# Altium schematic sheet EVAL-CN0349-PMDZ-AltiumDesignerSchematic-Rev0.SchDoc
size A4
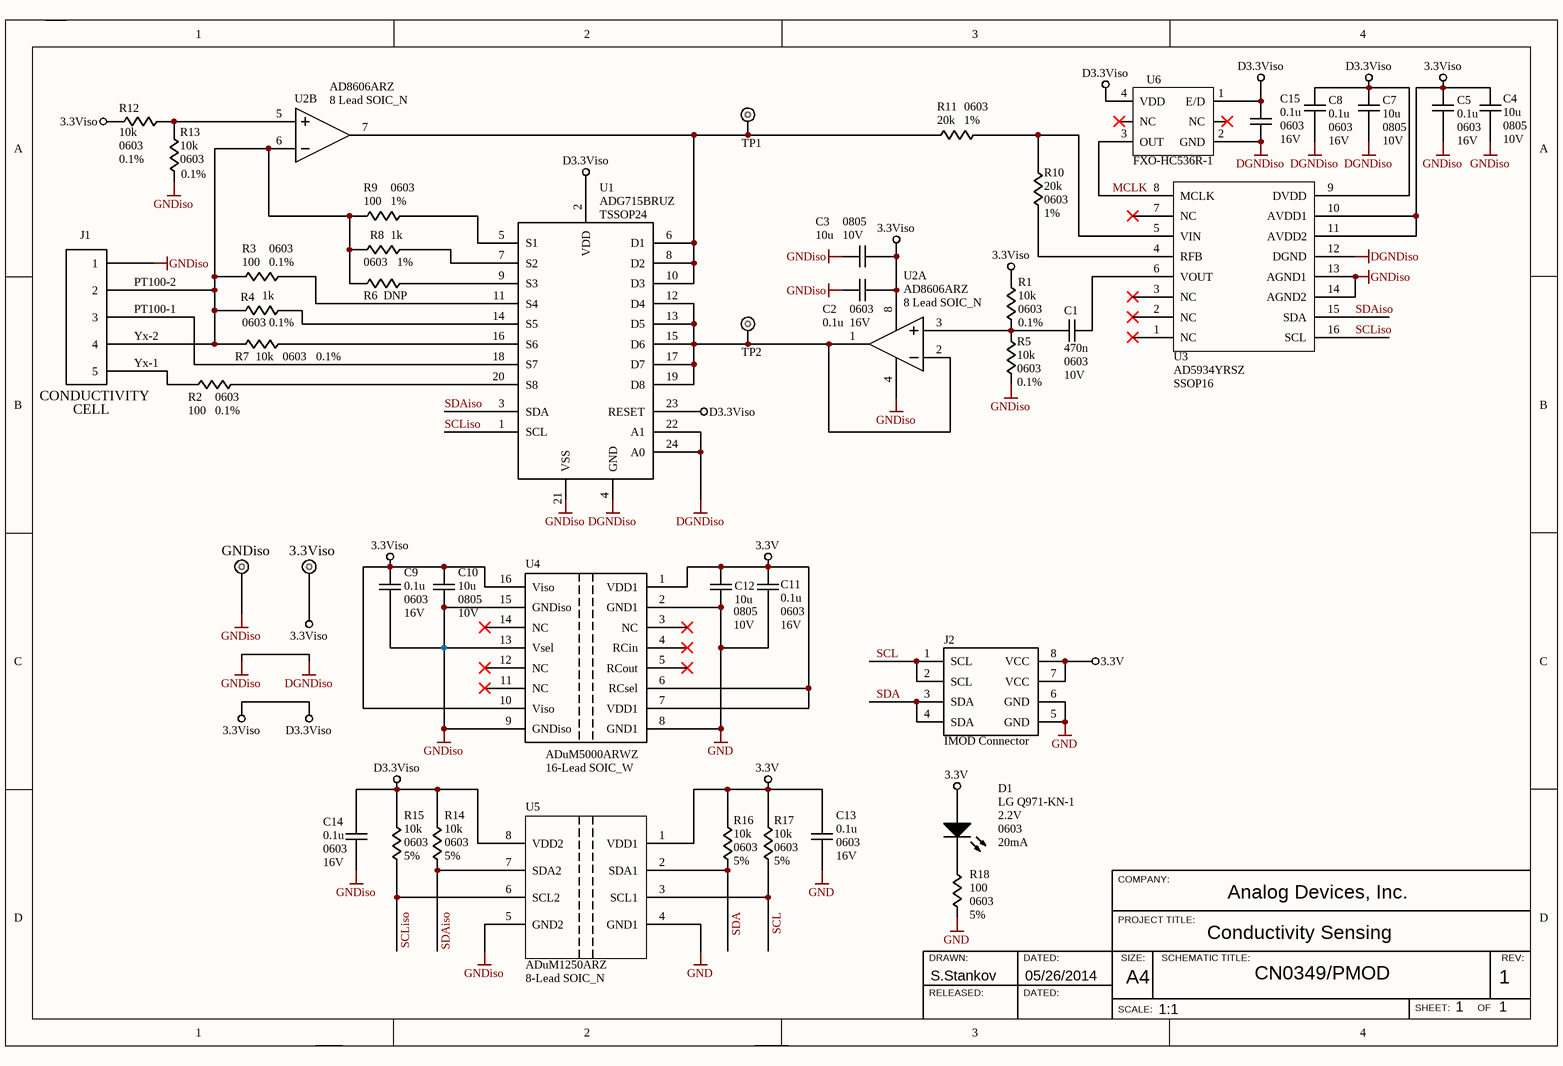
[diagram p0: EVAL-CN0349-PMDZ-AltiumDesignerSchematic-Rev0.SchDoc]

## Parts
3.3Viso  TestPoint  [TestPoint]  (value not drawn)
C1  value 470n  Footprint: 0603  Voltage: 10V  [0603 AD]  (hidden comment: Cap)
C2  value 0.1u  Footprint: 0603  Voltage: 16V  [0603 AD]
C3  value 10u  Footprint: 0805  Voltage: 10V  [0805 AD]
C4  value 10u  Footprint: 0805  Voltage: 10V  [0805 AD]
C5  value 0.1u  Footprint: 0603  Voltage: 16V  [0603 AD]
C7  value 10u  Footprint: 0805  Voltage: 10V  [0805 AD]
C8  value 0.1u  Footprint: 0603  Voltage: 16V  [0603 AD]
C9  value 0.1u  Footprint: 0603  Voltage: 16V  [0603 AD]
C10  value 10u  Footprint: 0805  Voltage: 10V  [0805 AD]
C11  value 0.1u  Footprint: 0603  Voltage: 16V  [0603 AD]
C12  value 10u  Footprint: 0805  Voltage: 10V  [0805 AD]
C13  value 0.1u  Footprint: 0603  Voltage: 16V  [0603 AD]  (hidden comment: Cap)
C14  value 0.1u  Footprint: 0603  Voltage: 16V  [0603 AD]  (hidden comment: Cap)
C15  value 0.1u  Footprint: 0603  Voltage: 16V  [0603 AD]
D1  value LG Q971-KN-1  Drop Voltage: 2.2V  Footprint: 0603  Current: 20mA  [0603 Diode]  (hidden comment: LED3)
GNDiso  TestPoint  [TestPoint]  (value not drawn)
J1  value J1  [Phoenix 5pin 2.54]  (hidden comment: CON5)
J2  value IMOD Connector  [IMOD Connector]  (hidden comment: IMOD_8 PIN)
R1  value 10k  Footrprint: 0603  Tolerance: 0.1%  [0603 AD]  (hidden comment: RESISTOR)
R2  value 100  Footrprint: 0603  Tolerance: 0.1%  [0603 AD]  (hidden comment: RESISTOR)
R3  value 100  Footrprint: 0603  Tolerance: 0.1%  [0603 AD]  (hidden comment: RESISTOR)
R4  value 1k  Footrprint: 0603  Tolerance: 0.1%  [0603 AD]  (hidden comment: RESISTOR)
R5  value 10k  Footrprint: 0603  Tolerance: 0.1%  [0603 AD]  (hidden comment: RESISTOR)
R6  value DNP  [0603 AD]  (hidden comment: RESISTOR)
R7  value 10k  Footrprint: 0603  Tolerance: 0.1%  [0603 AD]  (hidden comment: RESISTOR)
R8  value 1k  Footrprint: 0603  Tolerance: 1%  [0603 AD]  (hidden comment: RESISTOR)
R9  value 100  Footrprint: 0603  Tolerance: 1%  [0603 AD]  (hidden comment: RESISTOR)
R10  value 20k  Footrprint: 0603  Tolerance: 1%  [0603 AD]  (hidden comment: RESISTOR)
R11  value 20k  Footrprint: 0603  Tolerance: 1%  [0603 AD]  (hidden comment: RESISTOR)
R12  value 10k  Footrprint: 0603  Tolerance: 0.1%  [0603 AD]  (hidden comment: RESISTOR)
R13  value 10k  Footrprint: 0603  Tolerance: 0.1%  [0603 AD]  (hidden comment: RESISTOR)
R14  value 10k  Footrprint: 0603  Tolerance: 5%  [0603 AD]  (hidden comment: RESISTOR)
R15  value 10k  Footrprint: 0603  Tolerance: 5%  [0603 AD]  (hidden comment: RESISTOR)
R16  value 10k  Footrprint: 0603  Tolerance: 5%  [0603 AD]  (hidden comment: RESISTOR)
R17  value 10k  Footrprint: 0603  Tolerance: 5%  [0603 AD]  (hidden comment: RESISTOR)
R18  value 100  Footrprint: 0603  Tolerance: 5%  [0603 AD]  (hidden comment: RESISTOR)
TP1  TestPoint  [TestPoint]  (value not drawn)
TP2  TestPoint  [TestPoint]  (value not drawn)
U1  value ADG715BRUZ  [TSSOP24]  (hidden comment: ADG715)
U2  value AD8606ARZ  Footprint: 8 Lead SOIC_N  [SOICN_8]  (hidden comment: AD8606)  (parts A,B of 2)
U3  AD5934YRSZ  [SSOP16]
U4  value ADuM5000ARWZ  Footprint: 16-Lead SOIC_W  [SOICW_16]
U5  value ADuM1250ARZ  Footprint: 8-Lead SOIC_N  [SOICN_8]  (hidden comment: ADuM1251)
U6  SMD_OSCILLATOR  [Quad6]  (value not drawn)

## Nets
3.3V: C11.1 C12.2 C13.2 D1.A J2.7(VCC) J2.8(VCC) R16.2 R17.2 U4.1(VDD1) U4.6(RCsel) U4.7(VDD1) U5.1(VDD1)
3.3Viso: 3.3Viso.1 C2.2 C3.1 C4.2 C5.1 C7.2 C8.1 C9.1 C10.2 C14.2 C15.1 R1.2 R12.2 R14.2 R15.2 U1.2(VDD) U1.23(RESET) U2.8(V+) U3.9(DVDD) U3.10(AVDD1) U3.11(AVDD2) U4.10(Viso) U4.16(Viso) U5.8(VDD2) U6.1(E/D) U6.4(VDD)  [also labelled D3.3Viso]
DGNDiso: C2.1 C3.2 C4.1 C5.2 C7.1 C8.2 C9.2 C10.1 C14.1 C15.2 GNDiso.1 J1.1 R5.1 R13.1 U1.4(GND) U1.21(VSS) U1.22(A1) U1.24(A0) U2.4(V-) U3.12(DGND) U3.13(AGND1) U3.14(AGND2) U4.9(GNDiso) U4.13(Vsel) U4.15(GNDiso) U5.5(GND2) U6.2(GND)  [also labelled GNDiso]
GND: C11.2 C12.1 C13.1 J2.5(GND) J2.6(GND) R18.1 U4.2(GND1) U4.8(GND1) U5.4(GND1)
MCLK: U3.8(MCLK) U6.3(OUT)
PT100-1: J1.3 U1.18(S7)
PT100-2: J1.2 J1.4 R3.1 R4.1 R6.2 R7.1 R8.1 R9.1 U2.6(-INB)  [also labelled Yx-2]
SCL: J2.1(SCL) J2.2(SCL) R17.1 U5.3(SCL1)
SCLiso: R15.1 U1.1(SCL) U3.16(SCL) U5.6(SCL2)
SDA: J2.3(SDA) J2.4(SDA) R16.1 U5.2(SDA1)
SDAiso: R14.1 U1.3(SDA) U3.15(SDA) U5.7(SDA2)
Yx-1: J1.5 R2.1
NetC1_1: C1.1 U3.6(VOUT)
NetC1_2: C1.2 R1.1 R5.2 U2.3(+INA)
NetD1_K: D1.K R18.2
NetR2_2: R2.2 U1.20(S8)
NetR3_2: R3.2 U1.11(S4)
NetR4_2: R4.2 U1.14(S5)
NetR6_1: R6.1 U1.9(S3)
NetR7_2: R7.2 U1.16(S6)
NetR8_2: R8.2 U1.7(S2)
NetR9_2: R9.2 U1.5(S1)
NetR10_1: R10.1 R11.1 U3.5(VIN)
NetR10_2: R10.2 U3.4(RFB)
NetR11_2: R11.2 TP1.1 U1.6(D1) U1.8(D2) U1.10(D3) U2.7(OUTB)
NetR12_1: R12.1 R13.2 U2.5(+INB)
NetTP2_1: TP2.1 U1.12(D4) U1.13(D5) U1.15(D6) U1.17(D7) U1.19(D8) U2.1(OUTA) U2.2(-INA)

Not connected (* = marked no-connect by the designer): U3 1(NC)* 2(NC)* 3(NC)* 7(NC)*; U4 3(NC)* 4(RCin)* 5(RCout)* 11(NC)* 12(NC)* 14(NC)*; U6 ?1(NC)* ?2(NC)*

## Notes on the sheet
- (near J1) CONDUCTIVITY
- (near J1) CELL
- COMPANY:
- PROJECT TITLE:
- Conductivity Sensing
- Analog Devices, Inc.
- (near R18) DRAWN:
- RELEASED:
- S.Stankov
- DATED:
- 05/26/2014
- SIZE:
- A4
- SCHEMATIC TITLE:
- CN0349/PMOD
- 1
- REV:
- SCALE:
- 1:1
- SHEET:           OF
- Labels drawn without touching a wire or pin: FXO-HC536R-1

## Library data of the parts
C1-C5 C7-C15 = Cap: Capacitor
D1 = LED3: LED
J1 = CON5: Connector 5pin
J2 = IMOD_8 PIN: IMOD Connector
R6 = RESISTOR: Footrprint: 0603; Tolerance: 1%
U1 = ADG715: Integrated Switch
U2 = AD8606: Dual Operational Amplifier
U3 = AD5933: Integrated Circuit; Value: AD5934YRSZ
U4 = ADuM5000: Integrated Circuit
U5 = ADuM1251: Integrated Circuit
U6 = SMD_OSCILLATOR: FXO-HC536R-1